# EAGLE design nbedmbed_minipro_noimu (EAGLE 7.1.0)
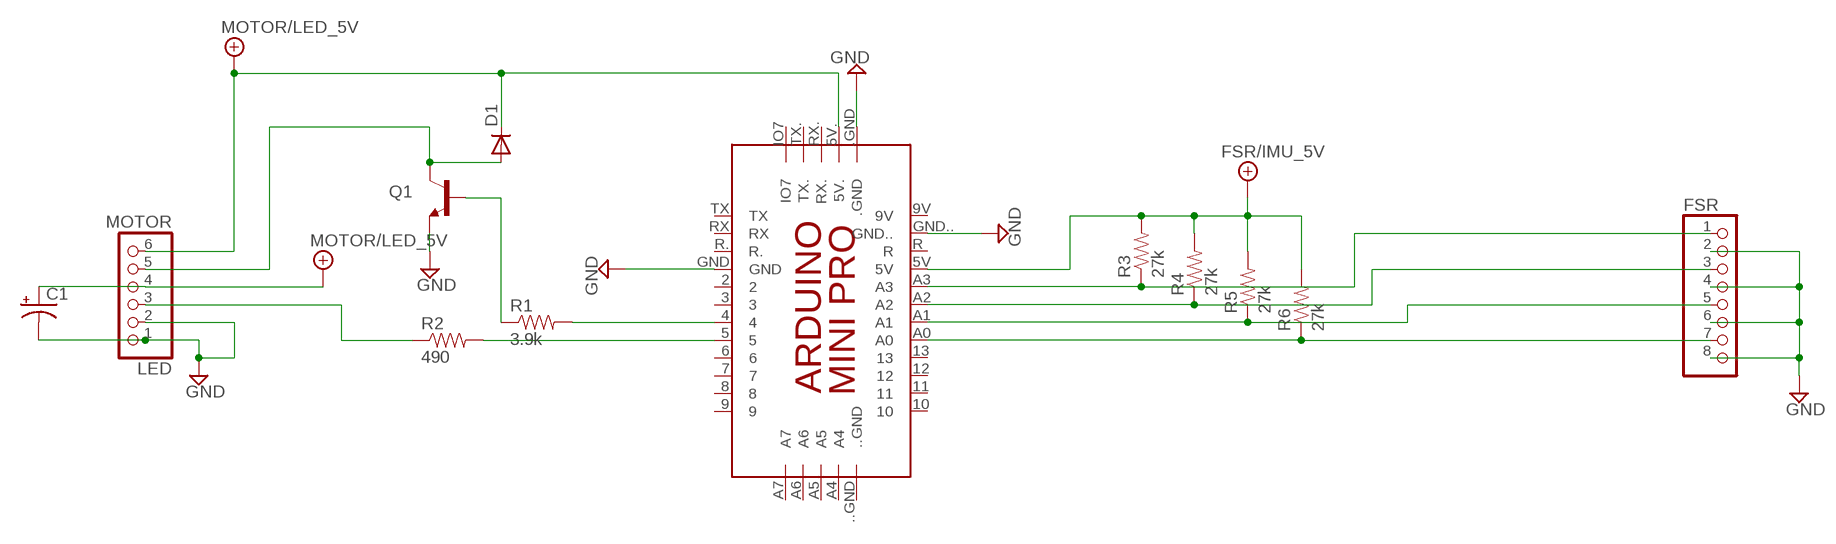
[diagram p0: schematic, sheet 1]

## Parts
C1  CAP_POLPTH1  [CPOL-RADIAL-100UF-25V]
D1  DIODE1N4148  [DIODE-1N4148]
FSR  PINHD-1X8BIG  [1X08-BIG]
LED  MOTOR  PINHD-1X6B  [1X06-BIG]
PCB2  ARDUINO_MINI_PRO  [ARDUINO_MINI_PRO]
Q1  TRANSISTOR_NPNTO-92-AMMO  [TO-92-AMMO]
R1  3.9k  RESISTORPTH-1/6W  [1/6W-RES]
R2  490  RESISTORPTH-1/6W  [1/6W-RES]
R3  27k  RESISTORPTH-1/6W  [1/6W-RES]
R4  27k  RESISTORPTH-1/6W  [1/6W-RES]
R5  27k  RESISTORPTH-1/6W  [1/6W-RES]
R6  27k  RESISTORPTH-1/6W  [1/6W-RES]

## Nets
FSR/IMU_5V: PCB2.5V R3.2 R4.2 R5.2 R6.2
GND: C1.2(-) FSR.2 FSR.4 FSR.6 FSR.8 LED.1 LED.2 PCB2..GND PCB2.GND PCB2.GND.. Q1.1(E)
MOTOR/LED_5V: C1.1(+) D1.C LED.4 LED.6 PCB2.5V.
N$1: PCB2.4 R1.2
N$2: PCB2.5 R2.2
N$3: Q1.2(B) R1.1
N$4: LED.3 R2.1
N$5: FSR.1 PCB2.A3 R3.1
N$6: FSR.3 PCB2.A2 R4.1
N$7: D1.A LED.5 Q1.3(C)
N$8: FSR.5 PCB2.A1 R5.1
N$9: FSR.7 PCB2.A0 R6.1
Unconnected: PCB2.2 PCB2.3 PCB2.6 PCB2.7 PCB2.8 PCB2.9 PCB2.9V PCB2.10 PCB2.11 PCB2.12 PCB2.13 PCB2...GND PCB2.A4 PCB2.A5 PCB2.A6 PCB2.A7 PCB2.IO7 PCB2.R PCB2.R. PCB2.RX PCB2.RX. PCB2.TX PCB2.TX.

## Library data of the parts
C1 = SparkFun-Capacitors:CAP_POL: Capacitor Polarized These are standard SMD and PTH capacitors. Normally 10uF, 47uF, and 100uF in electrolytic and tantalum varieties. Always verify the external diameter of the through hole cap, it varies with capacity, voltage, and manufacturer. The EIA devices should be standard.
D1 = SparkFun-DiscreteSemi:DIODE: Diode These are standard reverse protection diodes and small signal diodes. SMA package can handle up to about 1A. SOD-323 can handle about 200mA. What the SOD-323 package when ordering, there are some mfgs out there that are 5-pin packages.
FSR = adafruit:PINHD-1X8: PIN HEADER
LED = adafruit:PINHD-1X6: PIN HEADER
PCB2 = IDD:ARDUINO_MINI_PRO: Device for representing an Arduino Mini board with a footprint in an EAGLE design. Created by Dave Young for Element14. More EAGLE documentation at: http://www.element14.com/community/community/knode/cadsoft_eagle
Q1 = SparkFun-DiscreteSemi:TRANSISTOR_NPN: Generic NPN BJT MMBT2222A - TRANS-08049 (SOT-23, 1A 40V) MPSA42 - TRANS-09116 (SOT-23, 500mA 300V) MMBT5088LT1G - TRANS-11160 (SOT-23, 50 mA 30V)
R1-R6 = SparkFun-Resistors:RESISTOR: Resistor Basic schematic elements and footprints for 0603, 1206, and PTH resistors.

## Board
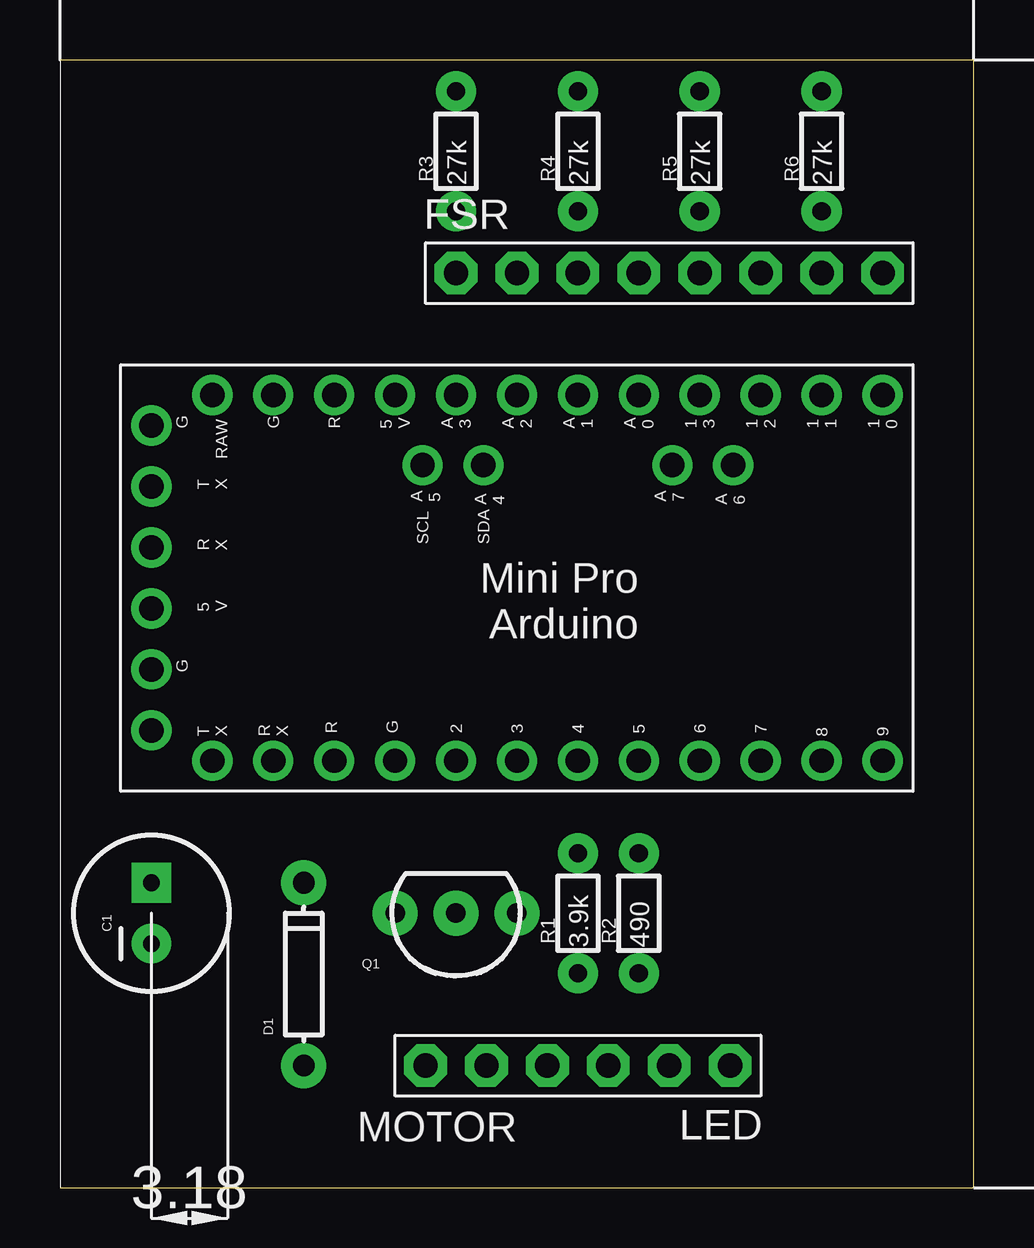
[diagram p1: board, top side]
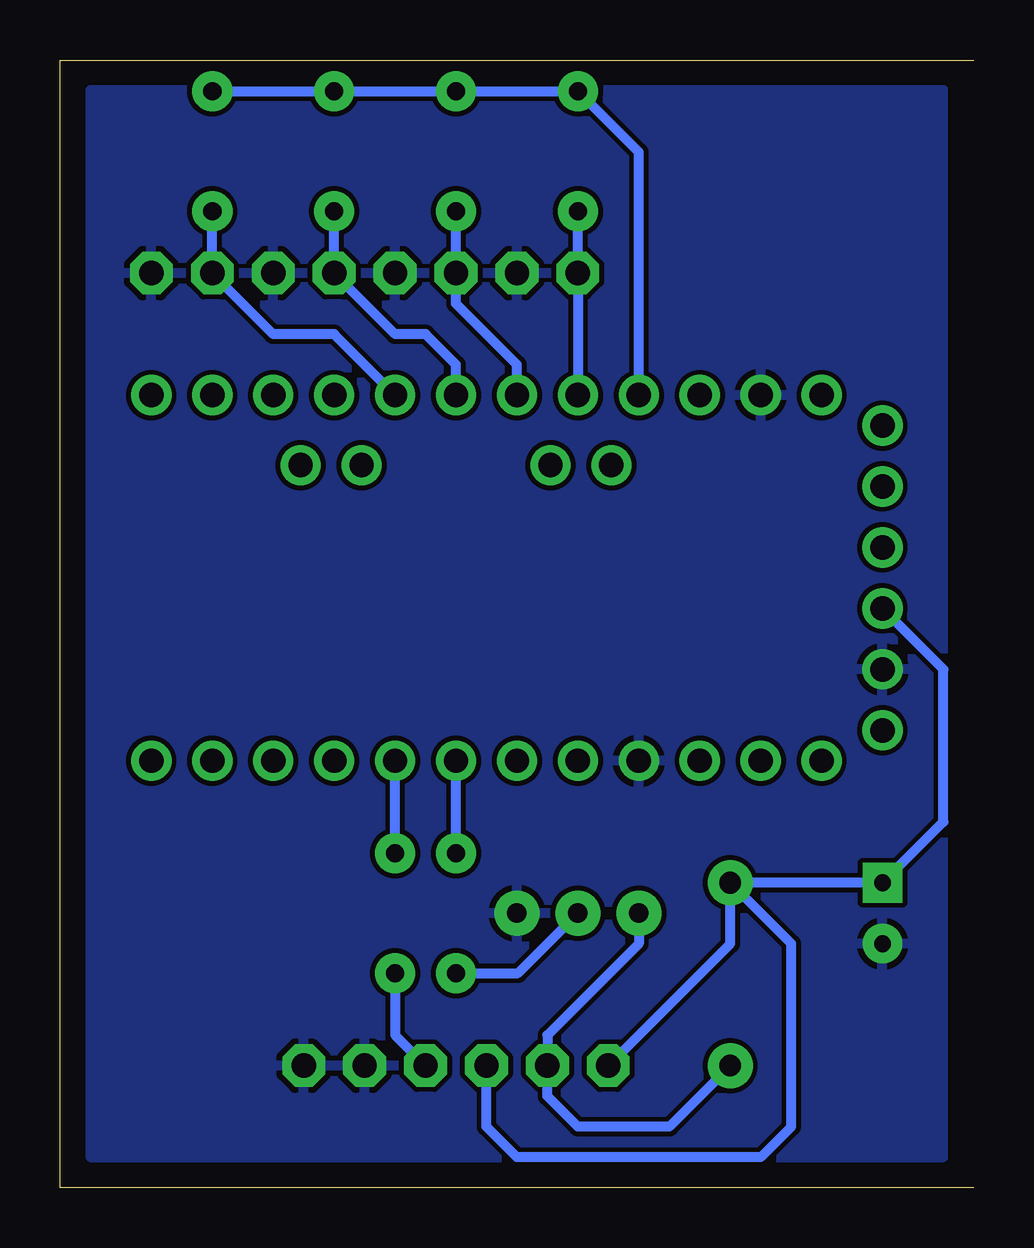
[diagram p2: board, bottom side, seen from below]

Size 38.1 x 46.98 mm. Coordinates in mm from the lower left corner, seen from the top.
Outline: 0,0 38.1,0 38.1,46.98 0,46.98
Copper layers (1*16): Top 0.035mm / dielectric 1.5mm / Bottom 0.035mm
Design rules "default": minimum track width 10mil, minimum drill 24mil, track to track 8mil, track to pad 8mil, pad to pad 8mil, via to via 8mil, smd to smd 8mil, copper to edge 40mil, drill to drill 8mil, minimum pad ring 10mil, minimum via ring 8mil, stop-mask expansion 4mil, vias tented up to drill 0mil, thermal gap 10mil

### Footprints (pad centres in the part's own frame; a part is rotated, then mirrored left to right if it is on the bottom)
CPOL-RADIAL-100UF-25V = drill 0.7 pad 1.651 square: 1 1.27,0 | drill 0.7 pad 1.651: 2 -1.27,0
DIODE-1N4148 = drill 0.9 pad 1.88: A -3.81,0; C 3.81,0
1X08-BIG = drill 1.016 pad 1.778 octagon: 1 -8.89,0; 2 -6.35,0; 3 -3.81,0; 4 -1.27,0; 5 1.27,0; 6 3.81,0; 7 6.35,0; 8 8.89,0
1X06-BIG = drill 1.016 pad 1.778 octagon: 1 -6.35,0; 2 -3.81,0; 3 -1.27,0; 4 1.27,0; 5 3.81,0; 6 6.35,0
ARDUINO_MINI_PRO = drill 1.016 pad 1.676: 2 19.05,16.51; 3 16.51,16.51; 4 13.97,16.51; 5 11.43,16.51; 5V 21.59,1.27; 5V. 31.75,10.16; 6 8.89,16.51; 7 6.35,16.51; 8 3.81,16.51; 9 1.27,16.51; 9V 29.21,1.27; 10 1.27,1.27; 11 3.81,1.27; 12 6.35,1.27; 13 8.89,1.27; ..GND 31.75,2.54; .GND 31.75,12.7; A0 11.43,1.27; A1 13.97,1.27; A2 16.51,1.27; A3 19.05,1.27; A4 17.907,4.191; A5 20.447,4.191; A6 7.493,4.191; A7 10.033,4.191; GND 21.59,16.51; GND.. 26.67,1.27; IO7 31.75,15.24; R 24.13,1.27; R. 24.13,16.51; RX 26.67,16.51; RX. 31.75,7.62; TX 29.21,16.51; TX. 31.75,5.08
TO-92-AMMO = drill 0.813 pad 1.88: 1 -2.54,0; 2 0,0; 3 2.54,0
1/6W-RES = drill 0.762 pad 1.676: 1 -2.5,0; 2 2.5,0

### Placement (x,y rotation side)
C1  3.81,11.43 90 top
D1  10.16,8.89 90 top
FSR  25.4,38.1 0 top
LED  21.59,5.08 180 top
PCB2  35.56,34.29 180 top
Q1  16.51,11.43 180 top
R1  21.59,11.43 90 top
R2  24.13,11.43 90 top
R3  16.51,43.18 90 top
R4  21.59,43.18 90 top
R5  26.67,43.18 90 top
R6  31.75,43.18 90 top

### Tracks (layer width: path | path; a pad name or v marks a point on that pad's centre or on a via)
FSR/IMU_5V
  Bottom 0.406: R6.2 R5.2 R4.2 R3.2 13.97,43.14 PCB2.5V
GND
  pour Bottom: 1.27,1.27 1.27,45.72 36.83,45.72 36.83,1.27
MOTOR/LED_5V
  Bottom 0.406: LED.6 10.16,10.16 D1.C | D1.C 7.62,10.16 7.62,2.54 8.89,1.27 19.05,1.27 20.32,2.54 LED.4 | D1.C C1.1 1.27,15.24 1.27,21.59 PCB2.5V.
N$1
  Bottom 0.406: R1.2 PCB2.4
N$2
  Bottom 0.406: R2.2 PCB2.5
N$3
  Bottom 0.406: R1.1 19.01,8.93 Q1.2
N$4
  Bottom 0.406: R2.1 24.13,6.35 LED.3
N$5
  Bottom 0.406: PCB2.A3 FSR.1 R3.1
N$6
  Bottom 0.406: PCB2.A2 19.05,34.29 21.59,36.83 FSR.3 R4.1
N$7
  Bottom 0.406: Q1.3 13.97,10.16 17.78,6.35 LED.5 17.78,3.81 16.51,2.54 12.7,2.54 D1.A
N$8
  Bottom 0.406: PCB2.A1 21.59,34.29 22.86,35.56 24.13,35.56 FSR.5 R5.1
N$9
  Bottom 0.406: PCB2.A0 26.67,35.56 29.21,35.56 FSR.7 R6.1